# EasyEDA Pro project ProPrj_四轴3.0_2025-12-06.epro, schematic 3V降压（4.5V-12V -> 5V）
Board Name: 3V降压（4.5V-12V -> 5V）; Create Date: 2025-08-22; Page Name: P1; Project Name: 四轴1.0; Schematic Name: 3V降压（4.5V-12V -> 5V）; Update Date: 2025-08-22; Company: 嘉立创EDA; Page Size: A4; Version: V1.0
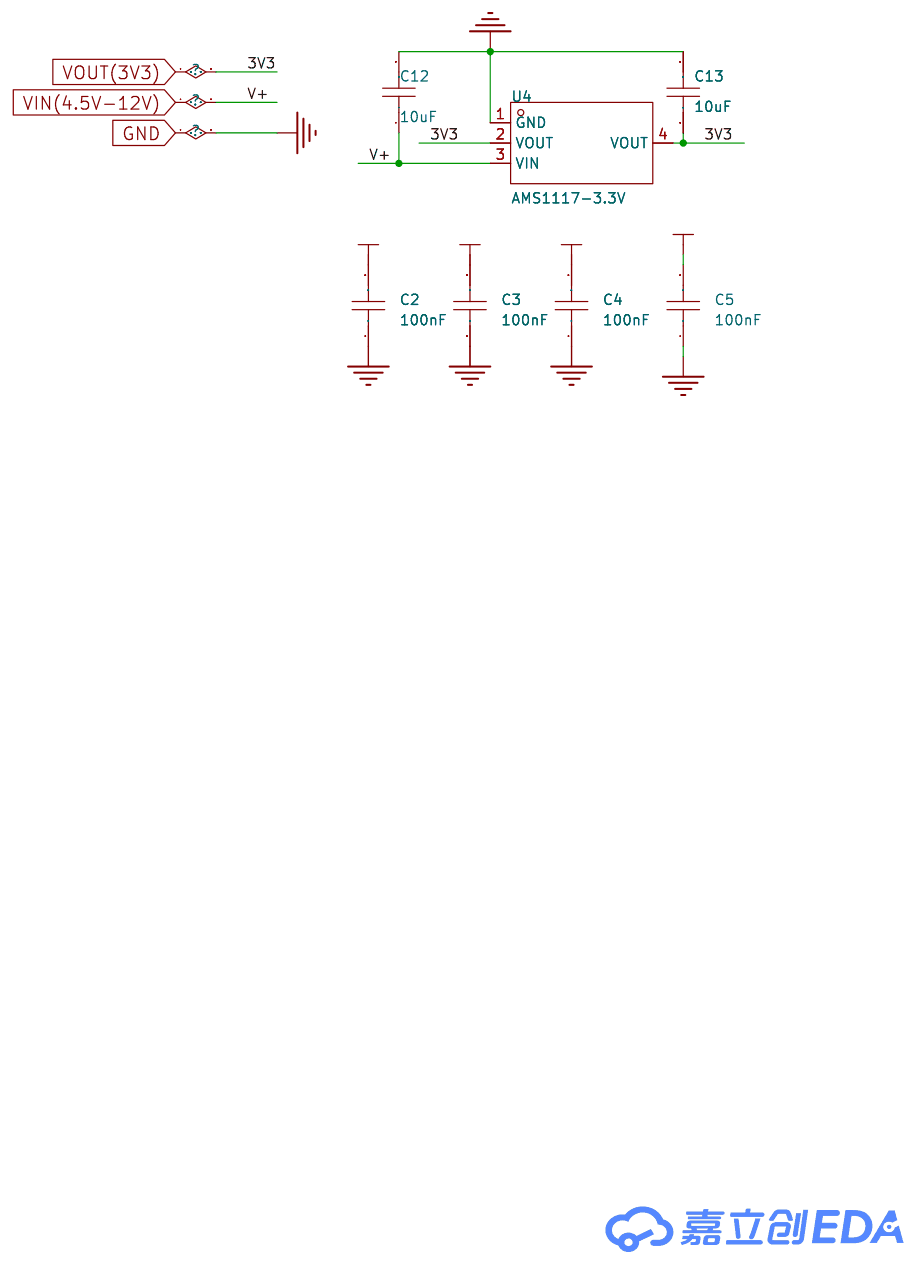
[diagram p0: schematic sheet]

## Parts
C2  100nF  [C0603]
C3  100nF  [C0603]
C4  100nF  [C0603]
C5  100nF  [C0603]
C12  10uF  [C0603]
C13  10uF  [C0603]
U4  AMS1117-3.3V  [SOT-223-4_L6.5-W3.5-P2.30-LS7.0-TR]

## Library data of the parts
C2-C5 = CGA0603X7R104K500JT: 容值:100nF;精度:±10%;额定电压:50V;温度系数:X7R;; LCSC Part Name: 100nF ±10% 50V; Supplier Part: C6119867; Manufacturer: HRE(芯声); Supplier Footprint: 0603; JLCPCB Part Class: Extended Part; Datasheet: https://atta.szlcsc.com/upload/public/pdf/source/20250103/C44077DA9E7B3EFAE02F22B6D3D1CBC9.pdf; Supplier: LCSC; Tolerance: ±10%; Voltage Rating: 50V; Temperature Coefficient: X7R
C12 C13 = CGA0603X5R106K100JT: 容值:10uF;精度:±10%;额定电压:10V;温度系数:X5R;; LCSC Part Name: 10uF ±10% 10V; Supplier Part: C6119842; Manufacturer: HRE(芯声); Supplier Footprint: 0603; JLCPCB Part Class: Extended Part; Supplier: LCSC; Tolerance: ±10%; Voltage Rating: 10V; Temperature Coefficient: X5R
U4 = AMS1117-3.3V: 输出类型:固定;工作电压:12V;输出电压:3.3V;输出电流:1A;输出极性:正极;; LCSC Part Name: 输入18V 输出3.3V 1A; Supplier Part: C5120765; Manufacturer: MSKSEMI(美森科); Supplier Footprint: SOT-223; JLCPCB Part Class: Extended Part; Datasheet: https://item.szlcsc.com/datasheet/AMS1117-3.3V/5706124.html; Supplier: LCSC; Output Type: 固定; Voltage - Supply: 12V; Output Voltage: 3.3V; Output Current: 1A; Voltage Dropout: 1.4V@(1A); standby current: 12mA; Features: 过流保护；过热保护; Operating Temperature: 0℃~+125℃@(Ta); Output Configuration: 正极; Number of Outputs: 1

## Nets
3V3: C2.2 C3.2 C4.2 C5.2 C13.1 U4.2(VOUT) U4.4(VOUT)
GND: C2.1 C3.1 C4.1 C5.1 C12.2 C13.2 U4.1(GND)
V+: C12.1 U4.3(VIN)
